# EAGLE design gesamt (EAGLE 9.4.0)
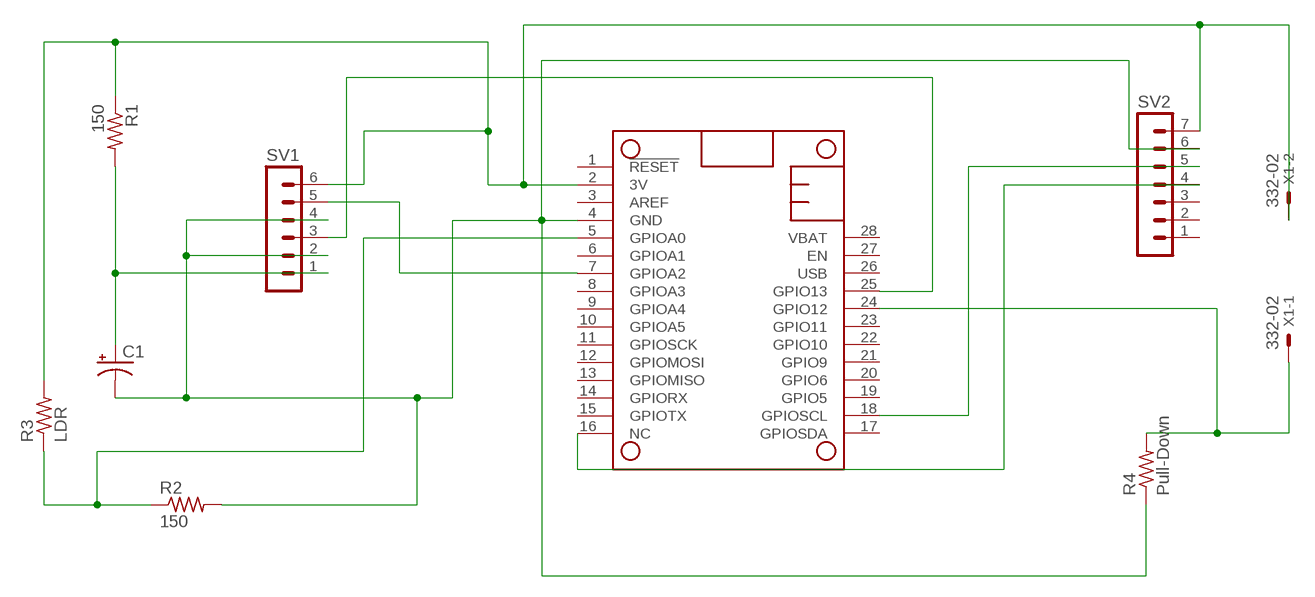
[diagram p0: schematic, sheet 1]

## Parts
C1  CPOL-USE2,5-6E  [E2,5-6E]
MS1  FEATHERWING  [FEATHERWING]
R1  150  R-US_0207/10  [0207/10]
R2  150  R-US_0207/10  [0207/10]
R3  LDR  R-US_V234/12  [V234/12]
R4  Pull-Down  R-US_0207/10  [0207/10]
SV1  MA06-1  [MA06-1]
SV2  MA07-1  [MA07-1]
X1  332-02  [332-02]

## Nets
3V: MS1.2(3V) R1.1 R3.2 SV1.6 SV2.7 X1.2
N$1: MS1.7(GPIOA2) SV1.5
N$2: C1.+ R1.2 SV1.1
N$3: C1.- MS1.4(GND) R2.2 R4.1 SV1.2 SV1.4 SV2.6
N$4: MS1.25(GPIO13) SV1.3
N$5: MS1.18(GPIOSCL) SV2.5
N$6: MS1.16(NC) SV2.4
N$7: MS1.5(GPIOA0) R2.1 R3.1
N$8: MS1.24(GPIO12) R4.2 X1.1
Unconnected: MS1.1(!RESET) MS1.3(AREF) MS1.6(GPIOA1) MS1.8(GPIOA3) MS1.9(GPIOA4) MS1.10(GPIOA5) MS1.11(GPIOSCK) MS1.12(GPIOMOSI) MS1.13(GPIOMISO) MS1.14(GPIORX) MS1.15(GPIOTX) MS1.17(GPIOSDA) MS1.19(GPIO5) MS1.20(GPIO6) MS1.21(GPIO9) MS1.22(GPIO10) MS1.23(GPIO11) MS1.26(USB) MS1.27(EN) MS1.28(VBAT) SV2.1 SV2.2 SV2.3

## Library data of the parts
C1 = adafruit:CPOL-US: POLARIZED CAPACITOR, American symbol
MS1 = adafruit:FEATHERWING
R1-R4 = adafruit:R-US_: RESISTOR, American symbol
SV1 = con-lstb:MA06-1: PIN HEADER; OC_FARNELL: unknown; OC_NEWARK: unknown
SV2 = con-lstb:MA07-1: PIN HEADER; OC_FARNELL: unknown; OC_NEWARK: unknown
X1 = con-garry:332-02: 2 Pin - 2mm Dual Row Source: www.mpe-connector.de / garry_shortform_2012.pdf

## Board
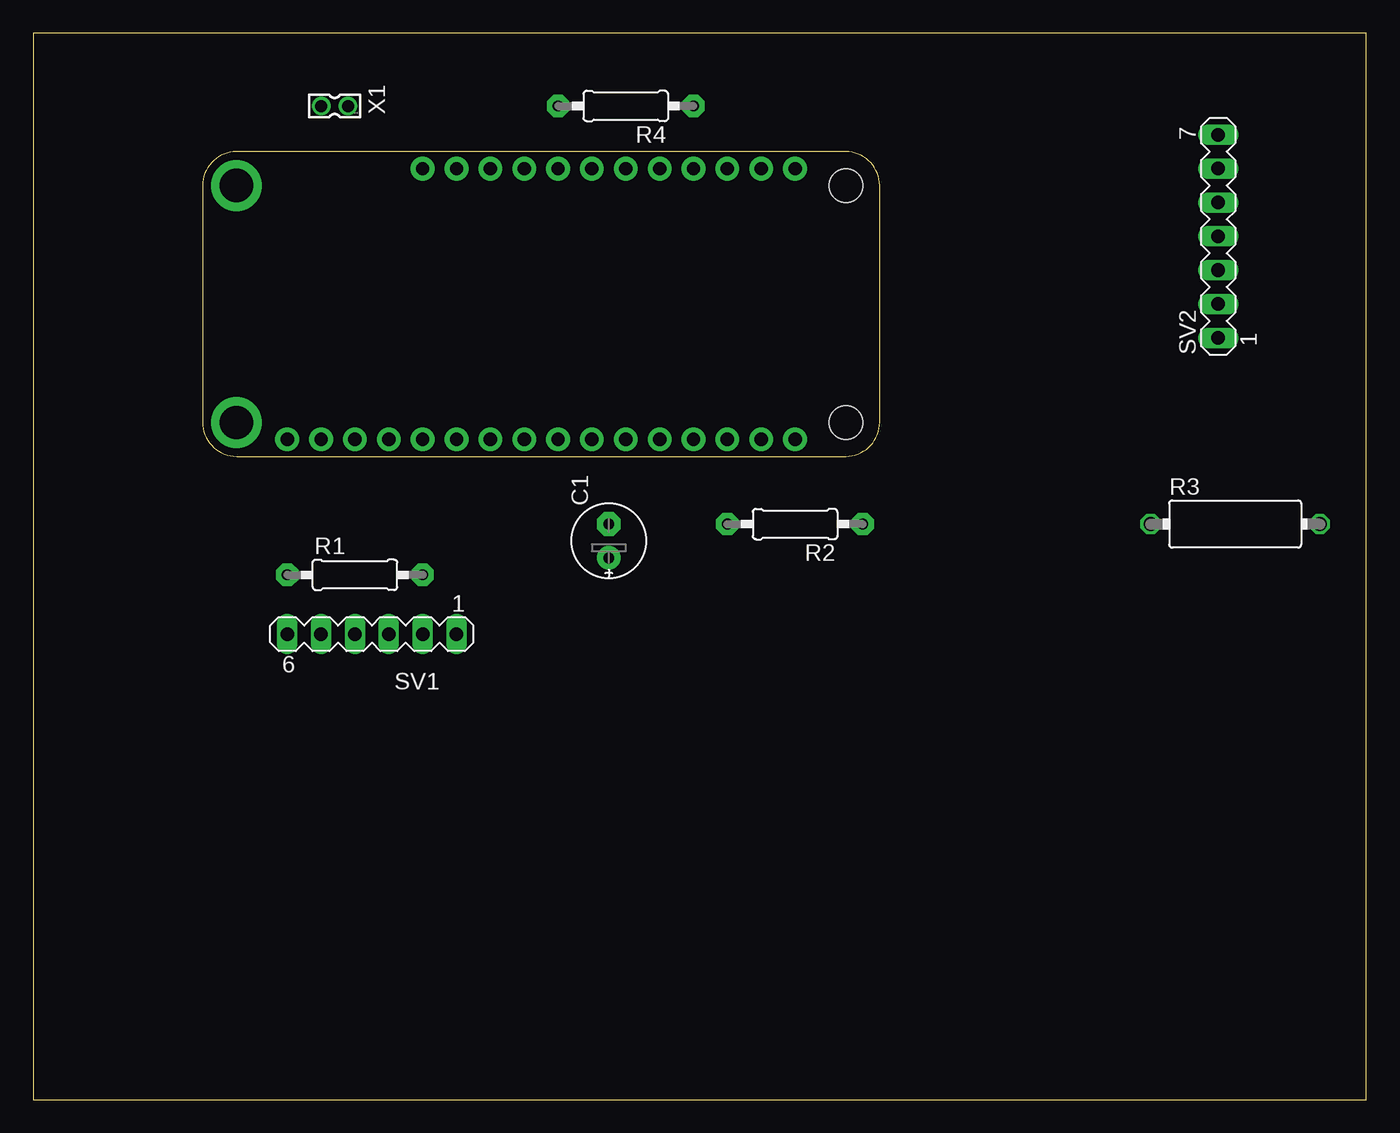
[diagram p1: board, top side]
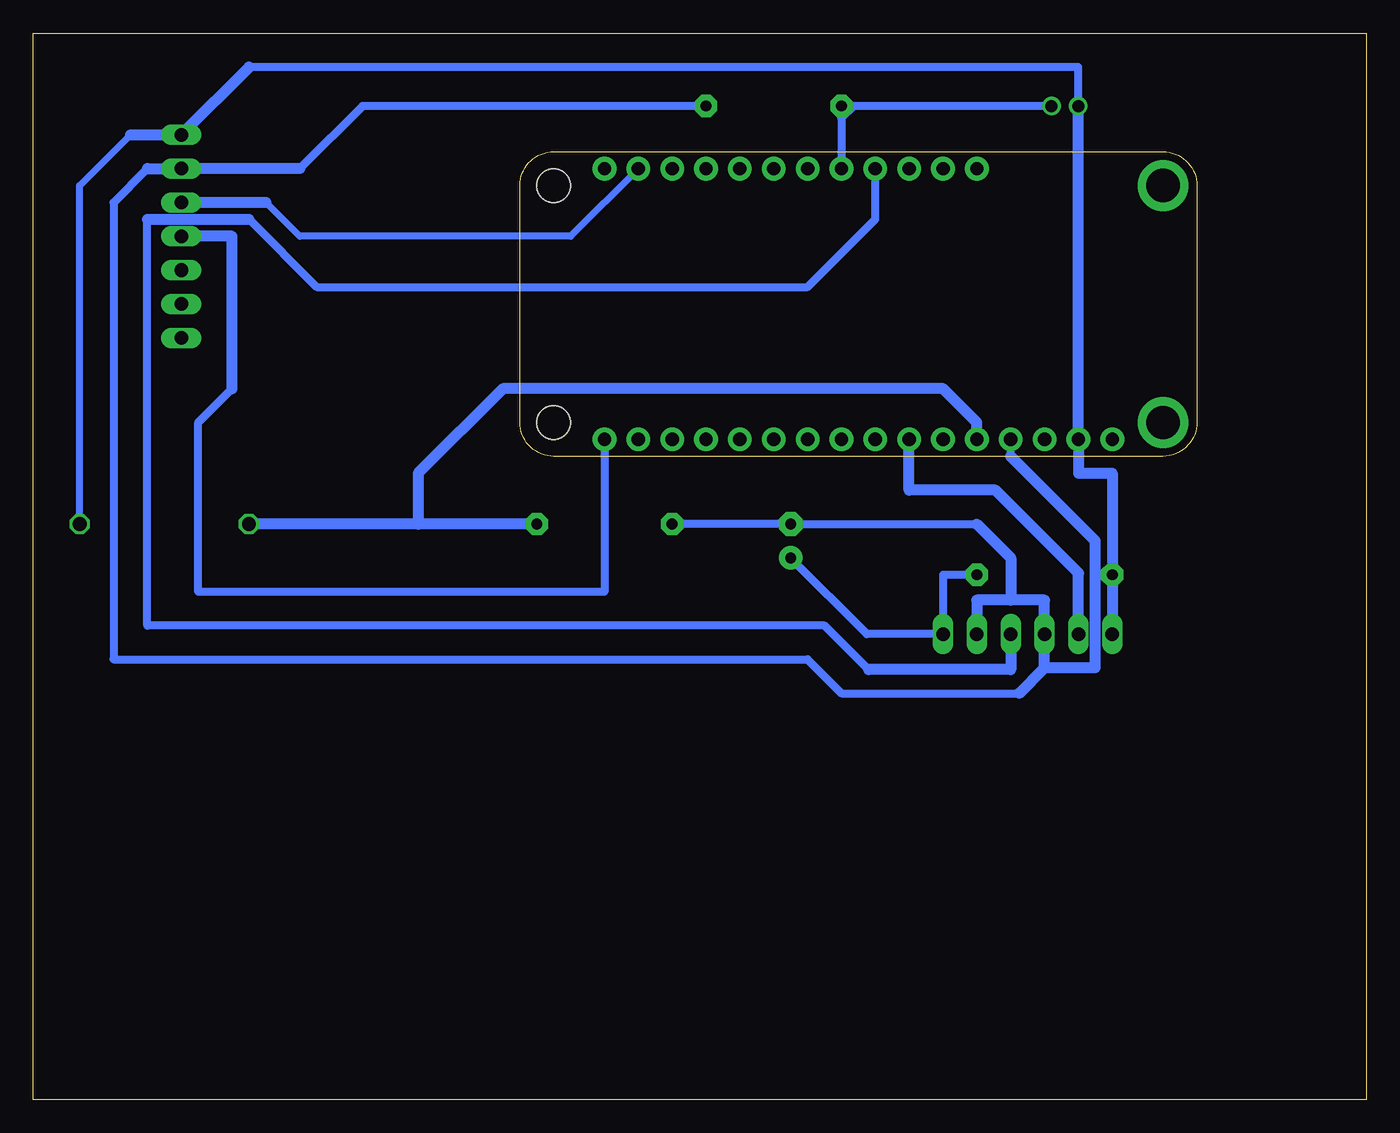
[diagram p2: board, bottom side, seen from below]

Size 100 x 80 mm. Coordinates in mm from the lower left corner, seen from the top.
Outline: 0,0 100,0 100,80 0,80 0,0
Copper layers (1*16): Top 0.035mm / dielectric 1.5mm / Bottom 0.035mm
Design rules "default": minimum track width 6mil, minimum drill 0.35mm, track to track 6mil, track to pad 6mil, pad to pad 6mil, via to via 6mil, smd to smd 6mil, copper to edge 40mil, drill to drill 6mil, minimum pad ring 10mil, minimum via ring 8mil, stop-mask expansion 4mil, vias tented up to drill 0mil, thermal gap 10mil

### Footprints (pad centres in the part's own frame; a part is rotated, then mirrored left to right if it is on the bottom)
E2,5-6E = drill 0.813 pad 1.778: + -1.27,0 | drill 0.813 pad 1.778 octagon: - 1.27,0
FEATHERWING = drill 1 pad 1.778: 1 6.35,1.27; 2 8.89,1.27; 3 11.43,1.27; 4 13.97,1.27; 5 16.51,1.27; 6 19.05,1.27; 7 21.59,1.27; 8 24.13,1.27; 9 26.67,1.27; 10 29.21,1.27; 11 31.75,1.27; 12 34.29,1.27; 13 36.83,1.27; 14 39.37,1.27; 15 41.91,1.27; 16 44.45,1.27; 17 44.45,21.59; 18 41.91,21.59; 19 39.37,21.59; 20 36.83,21.59; 21 34.29,21.59; 22 31.75,21.59; 23 29.21,21.59; 24 26.67,21.59; 25 24.13,21.59; 26 21.59,21.59; 27 19.05,21.59; 28 16.51,21.59 | drill 2.5 pad 3.81: P$1 2.54,20.32; P$2 2.54,2.54 | hole 2.54: 48.26,20.32; 48.26,2.54
0207/10 = drill 0.813 pad 1.676 octagon: 1 -5.08,0; 2 5.08,0
V234/12 = drill 1.016 octagon: 1 -6.35,0; 2 6.35,0
MA06-1 = drill 1.016 long: 1 -6.35,0; 2 -3.81,0; 3 -1.27,0; 4 1.27,0; 5 3.81,0; 6 6.35,0
MA07-1 = drill 1.016 long: 1 -7.62,0; 2 -5.08,0; 3 -2.54,0; 4 0,0; 5 2.54,0; 6 5.08,0; 7 7.62,0
332-02 = drill 0.9 pad 1.27: 1 0,-1; 2 0,1

### Placement (x,y rotation side)
C1  43.18,41.91 90 top
MS1  12.7,48.26 0 top
R1  24.13,39.37 0 top
R2  57.15,43.18 180 top
R3  90.17,43.18 0 top
R4  44.45,74.55 180 top
SV1  25.4,34.92 180 top
SV2  88.9,64.77 90 top
X1  22.61,74.55 90 top

### Tracks (layer width: path | path; a pad name or v marks a point on that pad's centre or on a via)
3V
  Bottom 0.508: 21.59,74.53 X1.2 | 92.71,72.39 96.52,68.58 R3.2
  Bottom 0.61: X1.2 21.61,77.47 83.82,77.47
  Bottom 0.813: 21.59,74.53 MS1.2 21.59,46.99 19.05,46.99 R1.1 SV1.6 | 92.71,72.39 SV2.7 83.82,77.47
N$1
  Bottom 0.813: MS1.7 34.29,45.72 27.81,45.72 21.59,39.5 SV1.5
N$2
  Bottom 0.61: C1.+ 37.47,34.92 SV1.1 31.75,39.37 R1.2
N$3
  Bottom 0.61: 29.21,43.18 C1.- R2.2 | 91.44,69.85 93.98,67.31 93.98,33.02 41.91,33.02 39.37,30.48 26.04,30.48 | R4.1 75.31,74.55 80.01,69.85 | 26.67,48.26 MS1.4
  Bottom 0.813: 24.13,32.38 SV1.4 24.13,37.47 26.67,37.47 | 24.13,32.38 20.32,32.38 20.32,41.91 26.67,48.26 | 91.44,69.85 SV2.6 80.01,69.85 | 26.67,37.47 29.21,37.47 SV1.2 | 29.21,43.18 26.67,40.64 26.67,37.47 | 26.04,30.48 24.13,32.38
N$4
  Bottom 0.61: 91.44,66.04 91.44,35.56 40.64,35.56 37.34,32.26 | 83.82,66.04 78.74,60.96 41.91,60.96 36.83,66.04 MS1.25
  Bottom 0.813: 91.44,66.04 83.82,66.04 | SV1.3 26.67,32.26 37.34,32.26
N$5
  Bottom 0.508: MS1.18 59.69,64.77 80.01,64.77 82.55,67.31
  Bottom 0.813: 82.55,67.31 SV2.5
N$6
  Bottom 0.61: MS1.16 57.15,38.1 87.63,38.1 87.63,50.8 85.09,53.34
  Bottom 0.813: 85.09,53.34 85.09,64.77 SV2.4
N$7
  Bottom 0.813: MS1.5 29.21,50.8 31.75,53.34 64.77,53.34 71.12,46.99 71.12,43.18 | R2.1 71.12,43.18 | 71.12,43.18 R3.1
N$8
  Bottom 0.508: 38.48,74.55 R4.2
  Bottom 0.61: R4.2 39.37,73.66 | 39.37,73.66 MS1.24 | X1.1 38.48,74.55 39.37,73.66